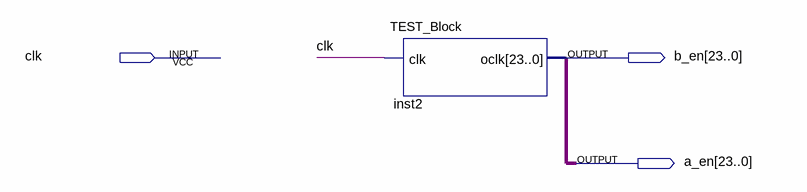
[diagram p0: schematic sheet]
// Quartus schematic TEST_Block2.bdf as structural Verilog: 1 symbols, 3 pins
module TEST_Block2 (
  input  clk,
  output [23:0] b_en,
  output [23:0] a_en
);

  TEST_Block inst2 (.clk(clk), .oclk(a_en));

  assign b_en = a_en;
endmodule
